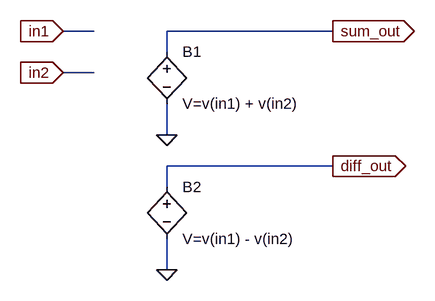
[diagram p0: schematic sum.asc]
sum.asc, the LTspice schematic file:
Version 4
SHEET 1 1520 680
WIRE 368 272 320 272
WIRE 736 272 480 272
WIRE 480 304 480 272
WIRE 368 336 320 336
WIRE 480 432 480 384
WIRE 736 480 480 480
WIRE 480 512 480 480
WIRE 480 640 480 592
FLAG 320 272 in1
IOPIN 320 272 In
FLAG 320 336 in2
IOPIN 320 336 In
FLAG 736 272 sum_out
IOPIN 736 272 Out
FLAG 480 432 0
FLAG 736 480 diff_out
IOPIN 736 480 Out
FLAG 480 640 0
SYMBOL bv 480 288 R0
SYMATTR InstName B1
SYMATTR Value V=v(in1) + v(in2)
SYMBOL bv 480 496 R0
SYMATTR InstName B2
SYMATTR Value V=v(in1) - v(in2)

The netlist it stands for:
* sum.asc
B1 sum_out 0 V=v(in1) + v(in2)
B2 diff_out 0 V=v(in1) - v(in2)
.backanno
.end